# Altium schematic sheet Stub_Tester.SchDoc: Stub_Tester
size A4; DrawnBy: Ian Glass; Address1: Auckland Bioengineering; Address2: Institute; Address3: Auckland, 1010; Address4: New Zealand; Revision: 1; SheetNumber: 2; SheetTotal: 4
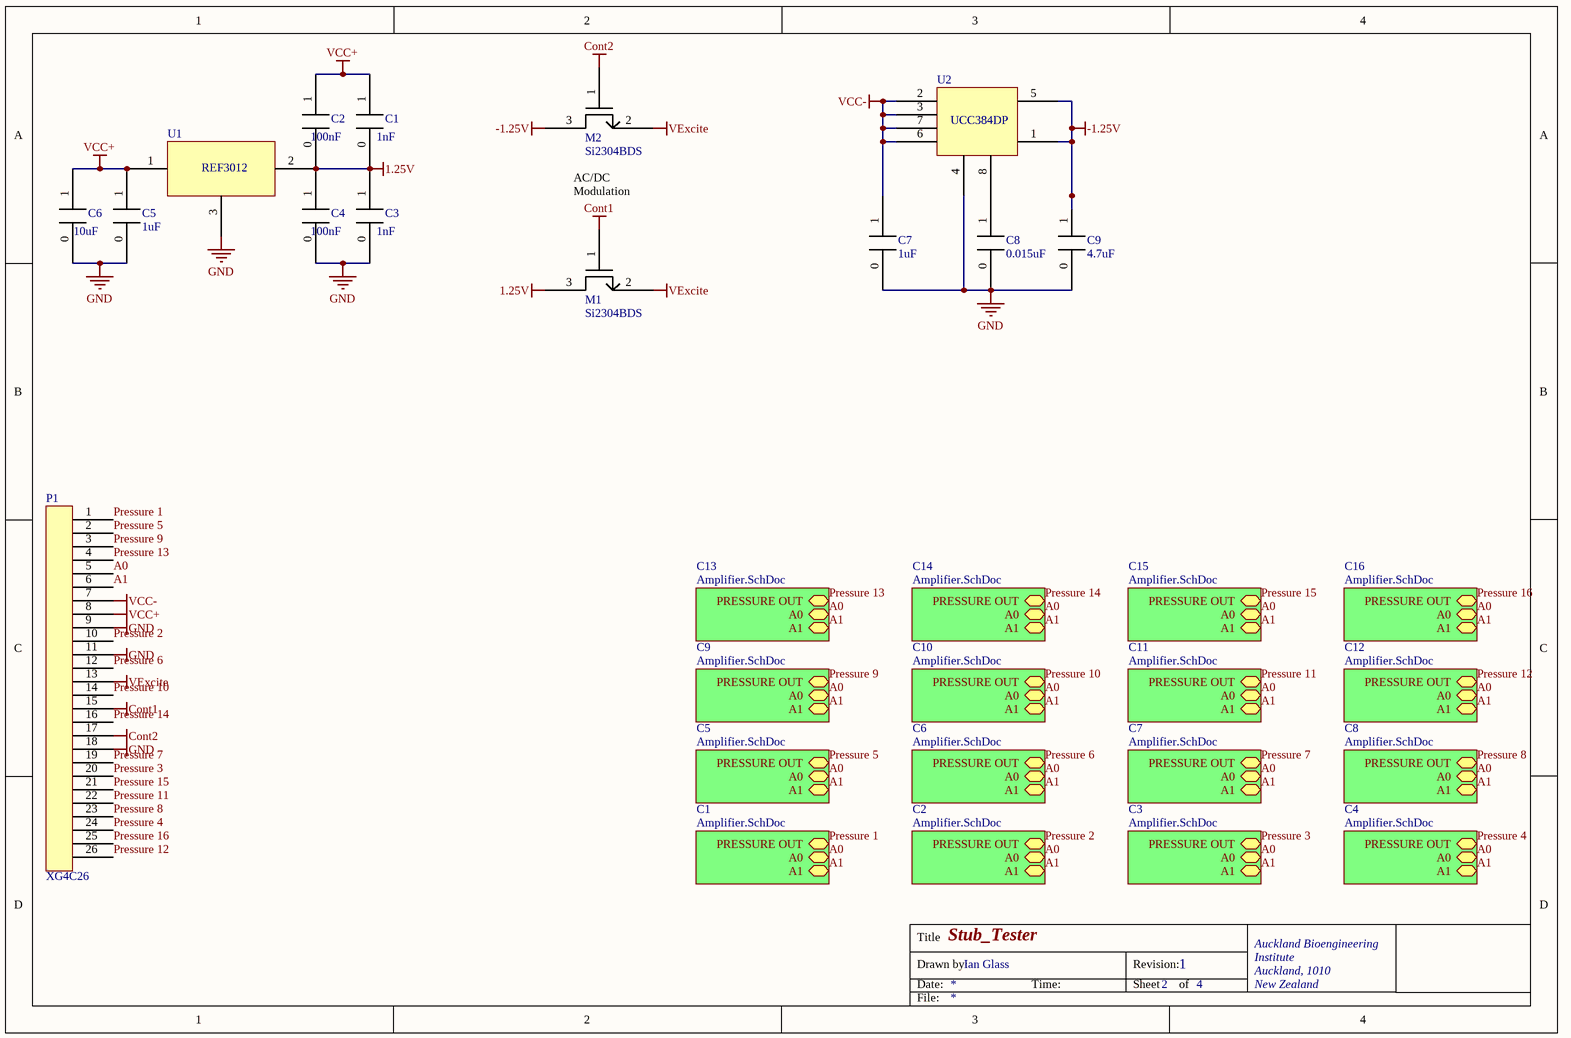
[diagram p0: Stub_Tester.SchDoc]

## Parts
C1  1nF  [C0603 1uF]
C2  100nF  [C0603 1uF]
C3  1nF  [C0603 1uF]
C4  100nF  [C0603 1uF]
C5  1uF  [C0603 1uF]
C6  10uF  [C0603 1uF]
C7  1uF  [C0603 1uF]
C8  0.015uF  [C0603 1uF]
C9  4.7uF  [C0603 1uF]
M1  Si2304BDS  [Si2304BDS]
M2  Si2304BDS  [Si2304BDS]
P1  XG4C26  [XG4C26]
U1  REF3012  [REF3012]  (value not drawn)
U2  UCC384DP  [UCC384DP]  (value not drawn)

## Sub-sheets
C1 = Amplifier.SchDoc: PRESSURE OUT, A0, A1
C2 = Amplifier.SchDoc: PRESSURE OUT, A0, A1
C3 = Amplifier.SchDoc: PRESSURE OUT, A0, A1
C4 = Amplifier.SchDoc: PRESSURE OUT, A0, A1
C5 = Amplifier.SchDoc: PRESSURE OUT, A0, A1
C6 = Amplifier.SchDoc: PRESSURE OUT, A0, A1
C7 = Amplifier.SchDoc: PRESSURE OUT, A0, A1
C8 = Amplifier.SchDoc: PRESSURE OUT, A0, A1
C9 = Amplifier.SchDoc: PRESSURE OUT, A0, A1
C10 = Amplifier.SchDoc: PRESSURE OUT, A0, A1
C11 = Amplifier.SchDoc: PRESSURE OUT, A0, A1
C12 = Amplifier.SchDoc: PRESSURE OUT, A0, A1
C13 = Amplifier.SchDoc: PRESSURE OUT, A0, A1
C14 = Amplifier.SchDoc: PRESSURE OUT, A0, A1
C15 = Amplifier.SchDoc: PRESSURE OUT, A0, A1
C16 = Amplifier.SchDoc: PRESSURE OUT, A0, A1

## Nets
1.25V: C1.0 C2.0 C3.1 C4.1 M1.3 U1.2
-1.25V: C9.1 M2.3 U2.1 U2.5
Cont1: M1.1 P1.15
Cont2: M2.1 P1.17
GND: C3.0 C4.0 C5.0 C6.0 C7.0 C8.0 C9.0 P1.9 P1.11 P1.18 U1.3 U2.4
VCC+: C1.1 C2.1 C5.1 C6.1 P1.8 U1.1
VCC-: C7.1 P1.7 U2.2 U2.3 U2.6 U2.7
VExcite: M1.2 M2.2 P1.13
A0: P1.5 ; sheet C1/A0, sheet C2/A0, sheet C3/A0, sheet C4/A0, sheet C5/A0, sheet C6/A0, sheet C7/A0, sheet C8/A0, sheet C9/A0, sheet C10/A0, sheet C11/A0, sheet C12/A0, sheet C13/A0, sheet C14/A0, sheet C15/A0, sheet C16/A0
A1: P1.6 ; sheet C1/A1, sheet C2/A1, sheet C3/A1, sheet C4/A1, sheet C5/A1, sheet C6/A1, sheet C7/A1, sheet C8/A1, sheet C9/A1, sheet C10/A1, sheet C11/A1, sheet C12/A1, sheet C13/A1, sheet C14/A1, sheet C15/A1, sheet C16/A1
Pressure 1: P1.1 ; sheet C1/PRESSURE OUT
Pressure 2: P1.10 ; sheet C2/PRESSURE OUT
Pressure 3: P1.20 ; sheet C3/PRESSURE OUT
Pressure 4: P1.24 ; sheet C4/PRESSURE OUT
Pressure 5: P1.2 ; sheet C5/PRESSURE OUT
Pressure 6: P1.12 ; sheet C6/PRESSURE OUT
Pressure 7: P1.19 ; sheet C7/PRESSURE OUT
Pressure 8: P1.23 ; sheet C8/PRESSURE OUT
Pressure 9: P1.3 ; sheet C9/PRESSURE OUT
Pressure 10: P1.14 ; sheet C10/PRESSURE OUT
Pressure 11: P1.22 ; sheet C11/PRESSURE OUT
Pressure 12: P1.26 ; sheet C12/PRESSURE OUT
Pressure 13: P1.4 ; sheet C13/PRESSURE OUT
Pressure 14: P1.16 ; sheet C14/PRESSURE OUT
Pressure 15: P1.21 ; sheet C15/PRESSURE OUT
Pressure 16: P1.25 ; sheet C16/PRESSURE OUT
NetC8_1: C8.1 U2.8

## Notes on the sheet
- (near M2) AC/DC Modulation
- Title
- Drawn by:
- Date:
- Time:
- Revision:
- Sheet
- of
- File:

## Library data of the parts
C1-C9 = C0603 1uF